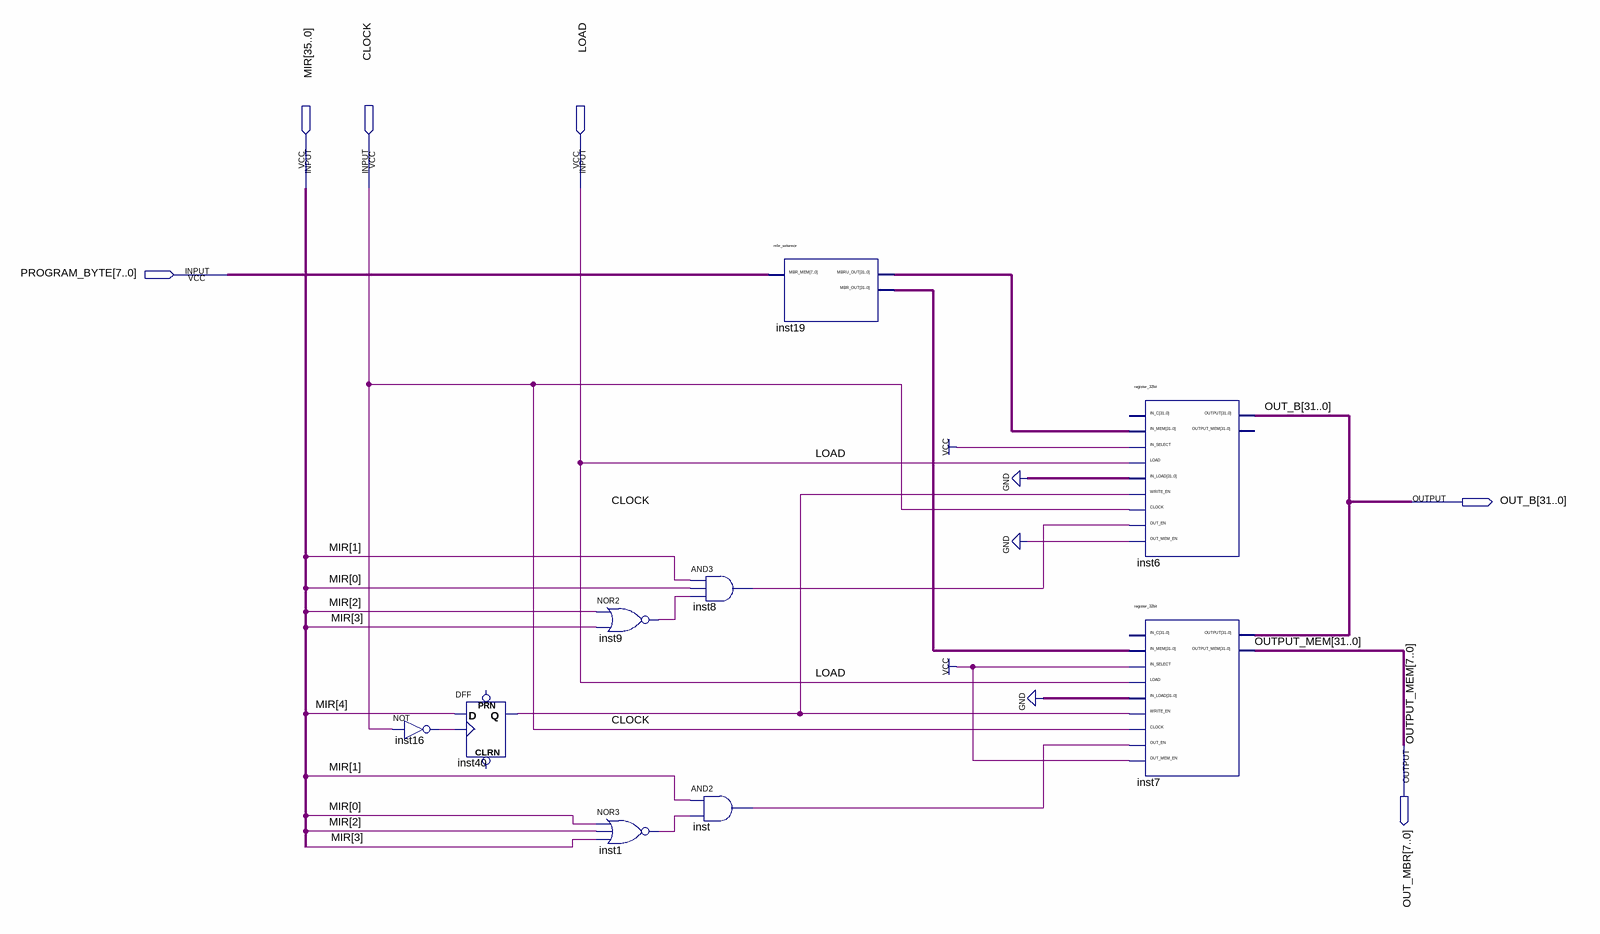
[diagram p0: schematic sheet]
// Quartus schematic MBR.bdf as structural Verilog: 9 symbols, 6 pins
module MBR (
  input  [35:0] MIR,
  input  CLOCK,
  input  LOAD,
  input  [7:0] PROGRAM_BYTE,
  output [31:0] OUT_B,
  output [7:0] OUT_MBR
);

  wire inst1_out, inst8_out, inst9_out, inst16_out, inst40_q, inst_out;
  wire [31:0] inst19_mbr_out, inst19_mbru_out;
  wire [31:8] OUTPUT_MEM;

  not inst16 (inst16_out, CLOCK);
  DFF inst40 (.CLK(inst16_out), .D(MIR[4]), .Q(inst40_q));  // open: CLRN, PRN
  nor inst9 (inst9_out, MIR[2], MIR[3]);
  nor inst1 (inst1_out, MIR[0], MIR[2], MIR[3]);
  and inst8 (inst8_out, MIR[1], MIR[0], inst9_out);
  and inst (inst_out, MIR[1], inst1_out);
  mbr_extensor inst19 (.MBR_MEM(PROGRAM_BYTE), .MBRU_OUT(inst19_mbru_out), .MBR_OUT(inst19_mbr_out));
  register_32bit inst6 (
    .IN_LOAD({32{1'b0}}), .LOAD(LOAD), .IN_MEM(inst19_mbru_out), .IN_SELECT(1'b1), .WRITE_EN(inst40_q),
    .CLOCK(CLOCK), .OUT_EN(inst8_out), .OUT_MEM_EN(1'b0), .OUTPUT(OUT_B));  // open: IN_C, OUTPUT_MEM
  register_32bit inst7 (
    .IN_LOAD({32{1'b0}}), .LOAD(LOAD), .IN_MEM(inst19_mbr_out), .IN_SELECT(1'b1), .WRITE_EN(inst40_q),
    .CLOCK(CLOCK), .OUT_EN(inst_out), .OUT_MEM_EN(1'b1), .OUTPUT(OUT_B), .OUTPUT_MEM({OUTPUT_MEM, OUT_MBR}));  // open: IN_C

  // Other names for the same wires on the sheet: OUTPUT_MEM[7:0] = OUT_MBR
endmodule
